# Altium schematic sheet Power_1.SchDoc
size A4; SheetNumber: 1; SheetTotal: 8
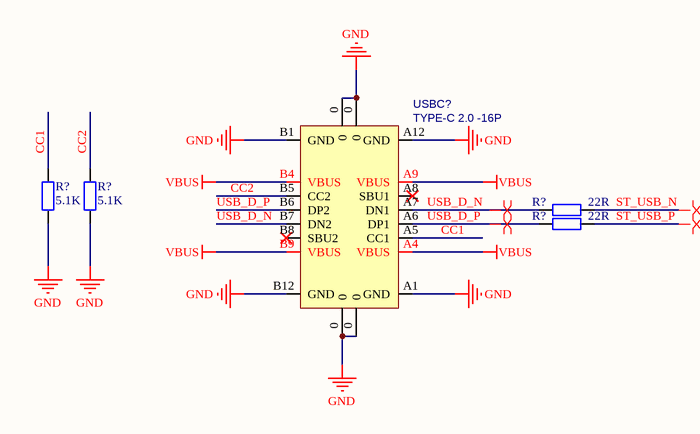
[diagram p0: Power_1.SchDoc]

## Parts
(Parts that share a designator on the sheet are numbered #1, #2 ... from top to bottom, then left to right.)
R?#1  22R  [R0402_L]
R?#2  5.1K  [R0402_L]
R?#3  5.1K  [R0402_L]
R?#4  22R  [R0402_L]
USBC?  TYPE-C 2.0 -16P  [USB-C-SMD_16P]

## Nets
GND: R?#2.1 R?#3.1 USBC?.0 USBC?.A1(GND) USBC?.A12(GND) USBC?.B1(GND) USBC?.B12(GND)
VBUS: USBC?.A4(VBUS) USBC?.A9(VBUS) USBC?.B4(VBUS) USBC?.B9(VBUS)
CC1: R?#2.2 USBC?.A5(CC1)
CC2: R?#3.2 USBC?.B5(CC2)
ST_USB_N: R?#1.2
ST_USB_P: R?#4.2
USB_D_N: R?#1.1 USBC?.A7(DN1) USBC?.B7(DN2)
USB_D_P: R?#4.1 USBC?.A6(DP1) USBC?.B6(DP2)

Not connected (* = marked no-connect by the designer): USBC? A8(SBU1)* B8(SBU2)*

## Layout directives
differential pair: ST_USB_N, ST_USB_P, USB_D_N, USB_D_P

## Library data of the parts
R?#1-R?#4 = R: 贴片电阻; 联系卖家，免费查找封装: 唯一出售店铺网址https://shop463601444.taobao.com; BOM名称: 贴片电阻
USBC? = USB2.0_Type-C_16Pin: USB2.0_Type-C_16Pin母座; 联系卖家 免费查找封装: 唯一出售店铺网址https://shop463601444.taobao.com; 联系卖家 免费技术支持: 封装库来自淘宝卖家ID：黄晶宝石